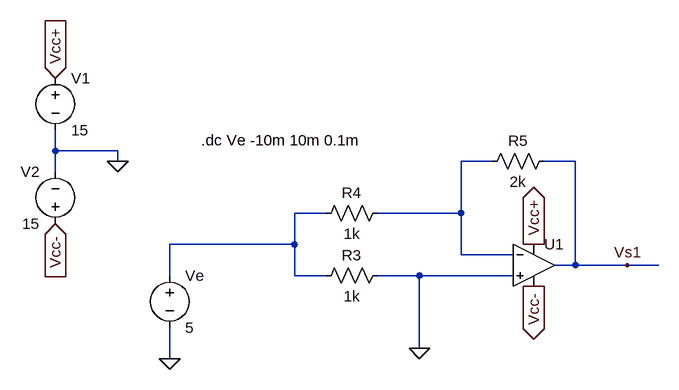
[diagram p0: schematic 2b_AOP2.asc]
2b_AOP2.asc, the LTspice schematic file:
Version 4
SHEET 1 1428 680
WIRE -112 -64 -112 -96
WIRE -16 -64 -112 -64
WIRE -16 -48 -16 -64
WIRE 560 -48 512 -48
WIRE 688 -48 640 -48
WIRE -112 -32 -112 -64
WIRE 304 32 256 32
WIRE 512 32 512 -48
WIRE 512 32 384 32
WIRE 256 80 256 32
WIRE 256 80 64 80
WIRE 512 96 512 32
WIRE 592 96 512 96
WIRE 688 112 688 -48
WIRE 688 112 656 112
WIRE 768 112 688 112
WIRE 816 112 768 112
WIRE 64 128 64 80
WIRE 256 128 256 80
WIRE 304 128 256 128
WIRE 448 128 384 128
WIRE 592 128 448 128
WIRE 448 240 448 128
WIRE 64 256 64 208
FLAG 64 256 0
FLAG 448 240 0
FLAG 768 112 Vs1
FLAG 624 80 Vcc+
IOPIN 624 80 Out
FLAG 624 144 Vcc-
IOPIN 624 144 Out
FLAG -16 -48 0
FLAG -112 -176 Vcc+
IOPIN -112 -176 In
FLAG -112 48 Vcc-
IOPIN -112 48 In
SYMBOL voltage 64 112 R0
SYMATTR InstName Ve
SYMATTR Value 5
SYMBOL res 400 16 R90
WINDOW 0 0 56 VBottom 2
WINDOW 3 32 56 VTop 2
SYMATTR InstName R4
SYMATTR Value 1k
SYMBOL res 400 112 R90
WINDOW 0 0 56 VBottom 2
WINDOW 3 32 56 VTop 2
SYMATTR InstName R3
SYMATTR Value 1k
SYMBOL OpAmps\\UniversalOpAmp 624 112 R0
SYMATTR InstName U1
SYMBOL res 656 -64 R90
WINDOW 0 0 56 VBottom 2
WINDOW 3 32 56 VTop 2
SYMATTR InstName R5
SYMATTR Value 2k
SYMBOL voltage -112 -192 R0
WINDOW 123 0 0 Left 0
WINDOW 39 0 0 Left 0
SYMATTR InstName V1
SYMATTR Value 15
SYMBOL voltage -112 64 R180
WINDOW 0 24 96 Left 2
WINDOW 3 24 16 Left 2
WINDOW 123 0 0 Left 0
WINDOW 39 0 0 Left 0
SYMATTR InstName V2
SYMATTR Value 15
TEXT 112 -80 Left 2 !.dc Ve -10m 10m 0.1m

The netlist it stands for:
* 2b_AOP2.asc
Ve N002 0 5
R4 N001 N002 1k
R3 0 N002 1k
XU1 0 N001 Vcc+ Vcc- Vs1 level1 Avol=1Meg GBW=10Meg Vos=0 En=0 Enk=0 In=0 Ink=0 Rin=500Meg  ; pins In+ In- V+ V- OUT
R5 Vs1 N001 2k
V1 Vcc+ 0 15
V2 Vcc- 0 15
.dc Ve -10m 10m 0.1m
.lib UniversalOpAmp1.lib
.backanno
.end